# Altium project LM2596_Buck_Converter.PrjPcb
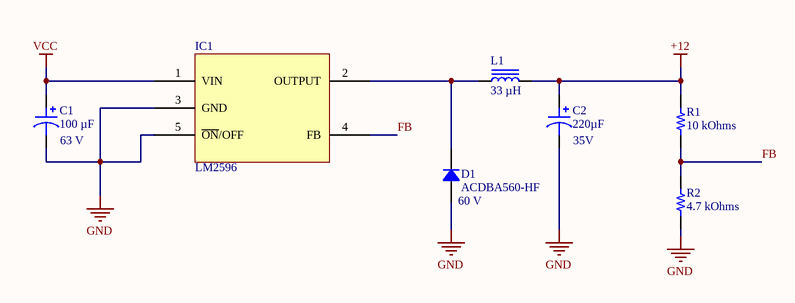
[diagram p0: LM2596.SchDoc]
1 sheet, 7 parts. Net scope: global (net labels, ports and power ports of the same name join across sheets).
Board file: LM2596.PcbDoc

## Sheet LM2596.SchDoc
size A3; SheetNumber: 1; SheetTotal: 1

### Parts
C1  100 µF  Voltage - Rated: 63 V  [CAP ALSMD POLY 8.3MM H10.5MM]
C2  220µF  Voltage - Rated: 35V  [CAP ALSMD 8.3MM H10.5MM]
D1  ACDBA560-HF  Voltage - DC Reverse (Vr) (Max): 60 V  [DO214AC SMA]
IC1  LM2596  [D2PAK]
L1  33 µH  [BOURNS SRR1280]
R1  10 kOhms  [RES 0805_2012]
R2  4.7 kOhms  [RES 0805_2012]

### Nets
+12: C2.1 L1.2 R1.2
GND: C1.2 C2.2 D1.1 IC1.3(GND) IC1.5(~{ON}/OFF) R2.1
VCC: C1.1 IC1.1(VIN)
FB: IC1.4(FB) R1.1 R2.2
NetD1_2: D1.2 IC1.2(OUTPUT) L1.1

### Library data of the parts
C1 = HHXJ630ARA101MJA0G: CAP ALUM HYB 100UF 20% 63V SMD; manufacturer: Chemi-Con; ESR (Equivalent Series Resistance): 30mOhm; Lifetime @ Temp.: 4000 Hrs @ 125°C; Ripple Current @ High Frequency: 2 A @ 100 kHz; Ripple Current @ Low Frequency: 300 mA @ 120 Hz; Surface Mount Land Size: 0.327" L x 0.327" W (8.30mm x 8.30mm); Type: Hybrid; Part Number: HHXJ630ARA101MJA0G; Applications: Automotive; Capacitance: 100 µF; componentlink2description: DigiKey Link; componentlink2url: https://www.digikey.com/en/products/detail/chemi-con/HHXJ630ARA101MJA0G/17875797; Height - Seated (Max): 0.413" (10.50mm); lastupdated: 3.06.2024 20:17:01; Lifecycle Status: Active; Minimum Order: 1; Mounting Type: Surface Mount; Operating Temperature: -55°C ~ 125°C; packaging: Bulk; partid: 5811; price: 0.69; Ratings: AEC-Q200; series: HXJ; Size / Dimension: 0.315" Dia (8.00mm); Supplier 1: DigiKey; Supplier Part Number 1: 565-HHXJ630ARA101MJA0G-ND; Tolerance: ±20%; value: 100 µF
C2 = UUR1V221MNL6GS: CAP ALUM 220UF 20% 35V SMD; manufacturer: Nichicon; Lifetime @ Temp.: 2000 Hrs @ 85°C; Ripple Current @ High Frequency: 319.8mA @ 10kHz; Ripple Current @ Low Frequency: 246mA @ 120Hz; Surface Mount Land Size: 0.327" L x 0.327" W (8.30mm x 8.30mm); Part Number: UUR1V221MNL6GS; Applications: General Purpose; Capacitance: 220µF; componentlink1description: Datasheet; componentlink1url: http://nichicon-us.com/english/products/pdfs/e-uur.pdf; componentlink2description: DigiKey Link; componentlink2url: http://digikey.com/product-detail/en/nichicon/UUR1V221MNL6GS/493-6238-1-ND/3438751; Device Package: Radial, Can - SMD; Height - Seated (Max): 0.413" (10.50mm); lastupdated: 2.09.2020 01:25:15; Lifecycle Status: Active; Minimum Order: 1; Mounting Type: Surface Mount; Operating Temperature: -40°C ~ 85°C; Package / Case: Radial, Can - SMD; packaging: TapeAndReel; partid: 7568; Part Status: Active; price: 0.20; series: UUR; Size / Dimension: 0.315" Dia (8.00mm); Supplier 1: DigiKey; Supplier Part Number 1: 493-6238-1-ND; Tolerance: ±20%; value: 220µF
D1 = ACDBA560-HF: DIODE SCHOTTKY 60V 5A DO214AC; Manufacturer: Comchip Technology; Capacitance @ Vr, F: 250pF @ 4V, 1MHz; Current - Reverse Leakage @ Vr: 500 µA @ 60 V; Speed: Fast Recovery =< 500ns, > 200mA (Io); Voltage - Forward (Vf) (Max) @ If: 700 mV @ 5 A; Part Number: ACDBA560-HF; ComponentLink1Description: Datasheet; ComponentLink1URL: http://www.comchiptech.com/admin/files/product/ACDBA560-HF%20RevA201382.pdf; ComponentLink2Description: DigiKey Link; ComponentLink2URL: https://www.digikey.com/en/products/detail/comchip-technology/ACDBA560-HF/7100903; Current - Average Rectified (Io): 5A; Diode Type: Schottky; LastUpdated: 3.06.2024 19:54:37; Lifecycle Status: Active; Minimum Order: 1; Mounting Type: Surface Mount; Operating Temperature - Junction: -55°C ~ 125°C; Package / Case: DO-214AC, SMA; Packaging: TapeAndReel; PartId: 1832; Part Status: Active; Price: 0.15; Series: -; Supplier 1: DigiKey; Supplier Part Number 1: 641-2078-1-ND; Supplier Device Package: DO-214AC (SMA)
IC1 = LM2598
L1 = SRR1280-330M: FIXED IND 33UH 3.5A 57 MOHM SMD; Manufacturer: Bourns Inc.; Current - Saturation: 3.3A; DC Resistance (DCR): 57mOhm Max; Frequency - Self Resonant: 9.5MHz; Inductance Frequency - Test: 100 kHz; Material - Core: Ferrite; Q @ Freq: 28 @ 2.52MHz; Shielding: Shielded; Tolerance: ±20%; Type: Drum Core, Wirewound; Part Number: SRR1280-330M; ComponentLink1Description: Datasheet; ComponentLink1URL: https://www.bourns.com/docs/Product-Datasheets/SRR1280.pdf; ComponentLink2Description: DigiKey Link; ComponentLink2URL: https://www.digikey.com/en/products/detail/bourns-inc/SRR1280-330M/1969998; Current Rating (Amps): 3.5 A; Device Package: Nonstandard; Height - Seated (Max): 0.315" (8.00mm); Inductance: 33 µH; LastUpdated: 3.06.2024 20:02:37; Lifecycle Status: Active; Minimum Order: 1; Mounting Type: Surface Mount; Operating Temperature: -40°C ~ 125°C; Package / Case: Nonstandard; Packaging: TapeAndReel; PartId: 25; Part Status: Active; Price: 0.51; Series: SRR1280; Size / Dimension: 0.492" L x 0.492" W (12.50mm x 12.50mm); Supplier 1: DigiKey; Supplier Part Number 1: SRR1280-330MCT-ND; Value: 33 µH
R1 = RNCP0805FTD10K0: RES 10K OHM 1% 1/4W 0805; Manufacturer: Stackpole Electronics Inc; Power (Watts): 0.25W, 1/4W; Temperature Coefficient: ±100ppm/°C; Part Number: RNCP0805FTD10K0; Value: 10 kOhms; ComponentLink1Description: Datasheet; ComponentLink1URL: https://www.seielect.com/catalog/sei-rncp.pdf; ComponentLink2Description: DigiKey Link; ComponentLink2URL: https://www.digikey.com/en/products/detail/stackpole-electronics-inc/RNCP0805FTD10K0/2240262; Composition: Thin Film; Device Package: 0805 (2012 Metric); Features: Anti-Sulfur; Height - Seated (Max): 0.025" (0.65mm); LastUpdated: 8.02.2024 21:02:37; Lifecycle Status: Active; Minimum Order: 1; Number of Terminations: 2; Operating Temperature: -55°C ~ 155°C; Package / Case: 0805 (2012 Metric); Packaging: TapeAndReel; PartId: 28021; Part Status: Active; Price: 0.01; Resistance: 10 kOhms; Series: RNCP; Size / Dimension: 0.079" L x 0.049" W (2.00mm x 1.25mm); Supplier 1: DigiKey; Supplier Part Number 1: RNCP0805FTD10K0CT-ND; Supplier Device Package: 0805; Tolerance: ±1%
R2 = CRCW08054K70FKEAHP: RES SMD 4.7K OHM 1% 1/2W 0805; Manufacturer: Vishay Dale; Power (Watts): 0.5W, 1/2W; Temperature Coefficient: ±100ppm/°C; Part Number: CRCW08054K70FKEAHP; Value: 4.7 kOhms; ComponentLink1Description: Datasheet; ComponentLink1URL: http://www.vishay.com/docs/20043/crcwhpe3.pdf; ComponentLink2Description: DigiKey Link; ComponentLink2URL: https://www.digikey.com/en/products/detail/vishay-dale/CRCW08054K70FKEAHP/2222346; Composition: Thick Film; Device Package: 0805 (2012 Metric); Features: Automotive AEC-Q200, Pulse Withstanding; Height - Seated (Max): 0.020" (0.50mm); LastUpdated: 8.02.2024 21:02:28; Lifecycle Status: Active; Minimum Order: 1; Number of Terminations: 2; Operating Temperature: -55°C ~ 155°C; Package / Case: 0805 (2012 Metric); Packaging: TapeAndReel; PartId: 30337; Part Status: Active; Price: 0.02; Ratings: AEC-Q200; Resistance: 4.7 kOhms; Series: CRCW-HP; Size / Dimension: 0.079" L x 0.049" W (2.00mm x 1.25mm); Supplier 1: DigiKey; Supplier Part Number 1: 541-4.70KTCT-ND; Supplier Device Package: 0805; Tolerance: ±1%